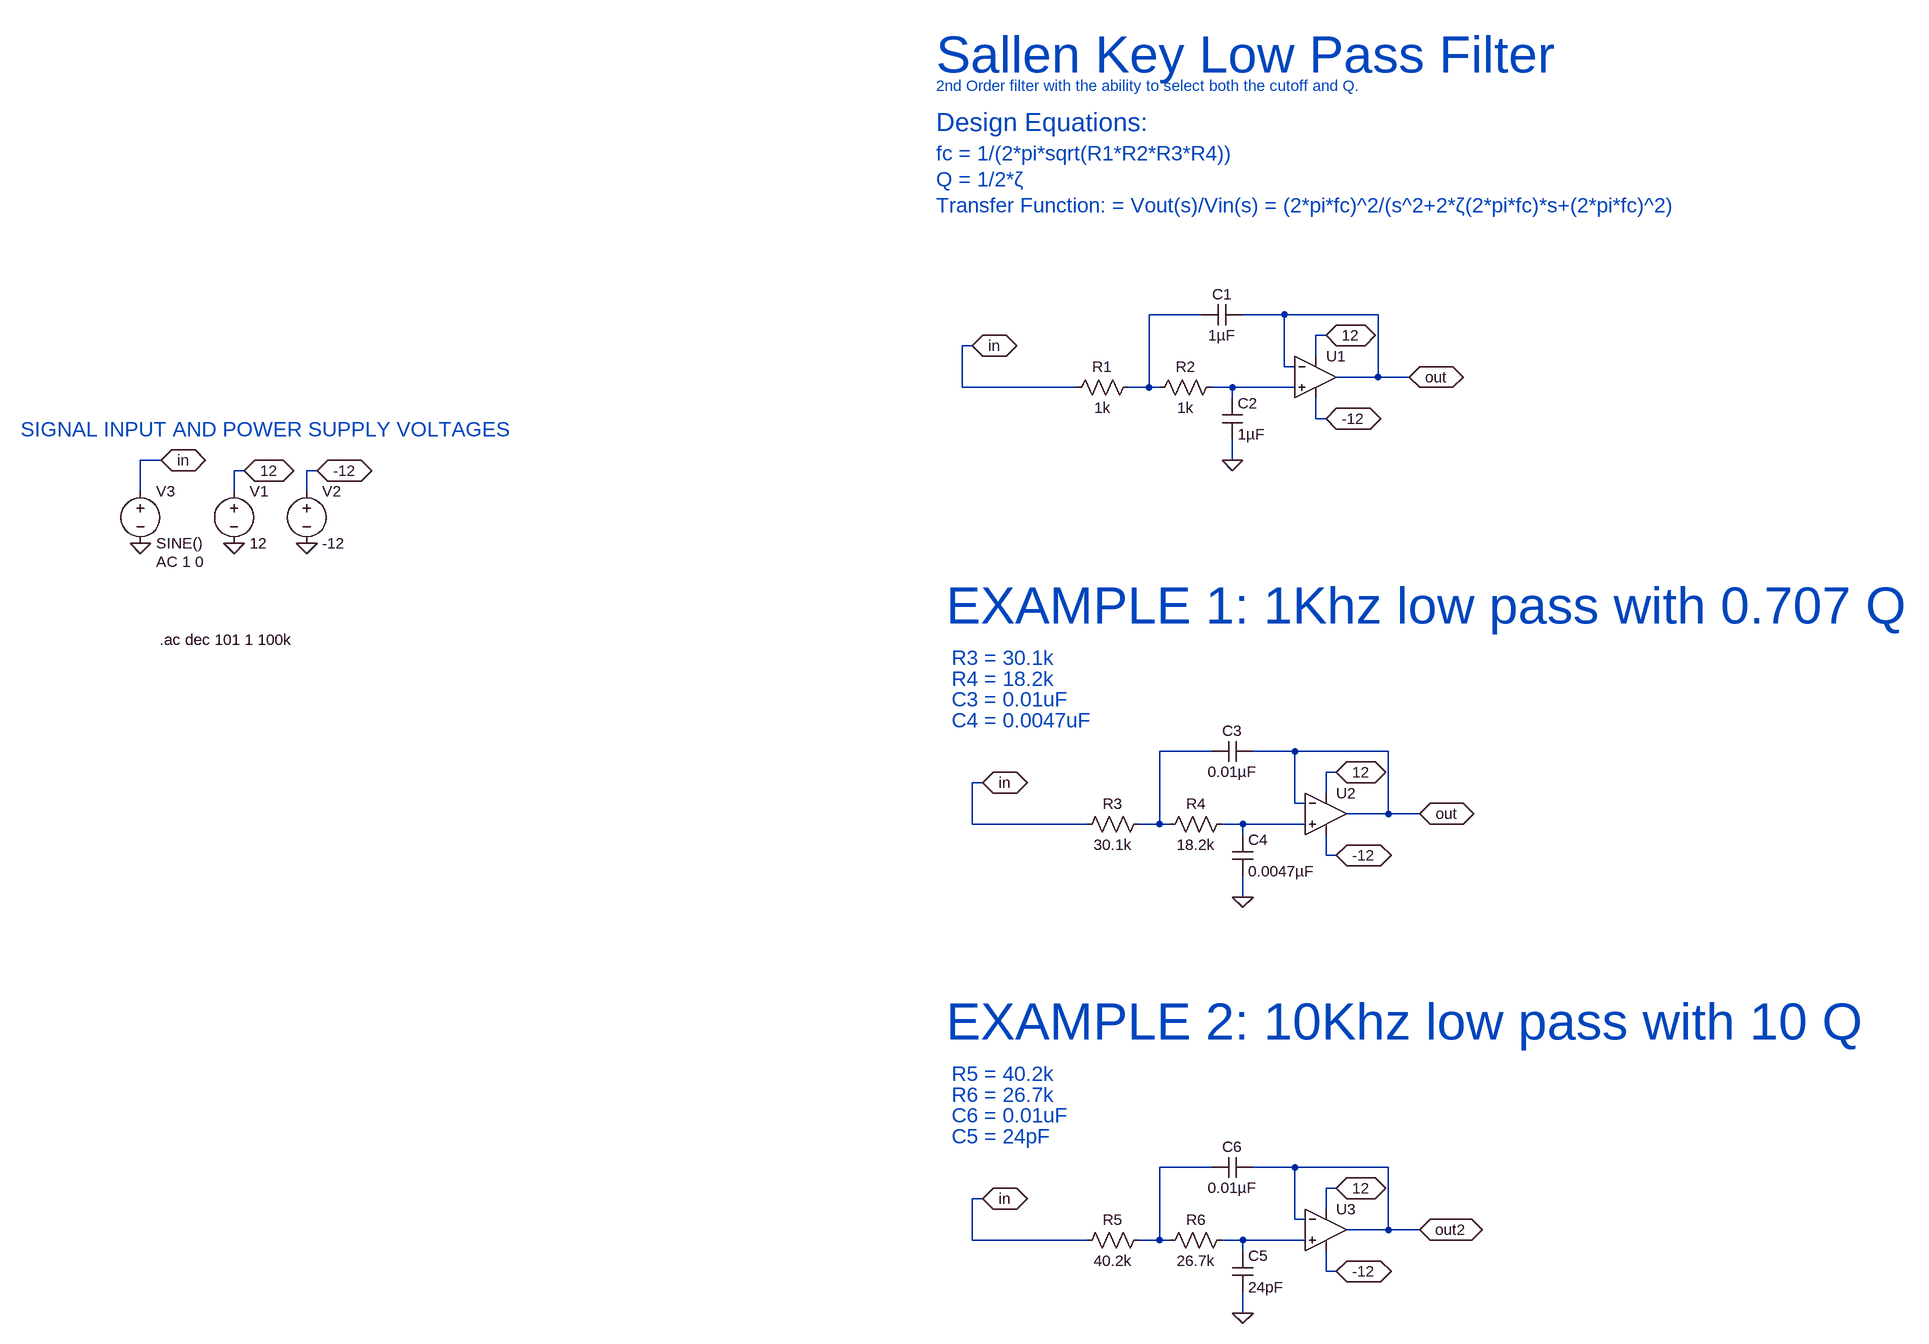
[diagram p0: schematic Sallen Key Low Pass.asc]
Sallen Key Low Pass.asc, the LTspice schematic file:
Version 4
SHEET 1 1684 1572
WIRE 64 16 -16 16
WIRE 192 16 128 16
WIRE 336 16 192 16
WIRE 256 48 240 48
WIRE -288 64 -304 64
WIRE 240 80 240 48
WIRE 192 96 192 16
WIRE 208 96 192 96
WIRE 336 112 336 16
WIRE 336 112 272 112
WIRE 384 112 336 112
WIRE -304 128 -304 64
WIRE -128 128 -304 128
WIRE -16 128 -16 16
WIRE -16 128 -48 128
WIRE 0 128 -16 128
WIRE 112 128 80 128
WIRE 208 128 112 128
WIRE 112 144 112 128
WIRE 240 176 240 144
WIRE 256 176 240 176
WIRE -1536 240 -1568 240
WIRE 112 240 112 208
WIRE -1408 256 -1424 256
WIRE -1296 256 -1312 256
WIRE -1568 288 -1568 240
WIRE -1424 288 -1424 256
WIRE -1312 288 -1312 256
WIRE 80 688 0 688
WIRE 208 688 144 688
WIRE 352 688 208 688
WIRE 272 720 256 720
WIRE -272 736 -288 736
WIRE 256 752 256 720
WIRE 208 768 208 688
WIRE 224 768 208 768
WIRE 352 784 352 688
WIRE 352 784 288 784
WIRE 400 784 352 784
WIRE -288 800 -288 736
WIRE -112 800 -288 800
WIRE 0 800 0 688
WIRE 0 800 -32 800
WIRE 16 800 0 800
WIRE 128 800 96 800
WIRE 224 800 128 800
WIRE 128 816 128 800
WIRE 256 848 256 816
WIRE 272 848 256 848
WIRE 128 912 128 880
WIRE 80 1328 0 1328
WIRE 208 1328 144 1328
WIRE 352 1328 208 1328
WIRE 272 1360 256 1360
WIRE -272 1376 -288 1376
WIRE 256 1392 256 1360
WIRE 208 1408 208 1328
WIRE 224 1408 208 1408
WIRE 352 1424 352 1328
WIRE 352 1424 288 1424
WIRE 400 1424 352 1424
WIRE -288 1440 -288 1376
WIRE -112 1440 -288 1440
WIRE 0 1440 0 1328
WIRE 0 1440 -32 1440
WIRE 16 1440 0 1440
WIRE 128 1440 96 1440
WIRE 224 1440 128 1440
WIRE 128 1456 128 1440
WIRE 256 1488 256 1456
WIRE 272 1488 256 1488
WIRE 128 1552 128 1520
FLAG 256 48 12
IOPIN 256 48 BiDir
FLAG 256 176 -12
IOPIN 256 176 BiDir
FLAG -1408 256 12
IOPIN -1408 256 BiDir
FLAG -1296 256 -12
IOPIN -1296 256 BiDir
FLAG -1424 368 0
FLAG -1312 368 0
FLAG 112 240 0
FLAG -1568 368 0
FLAG -1536 240 in
IOPIN -1536 240 BiDir
FLAG -288 64 in
IOPIN -288 64 BiDir
FLAG 384 112 out
IOPIN 384 112 BiDir
FLAG 272 720 12
IOPIN 272 720 BiDir
FLAG 272 848 -12
IOPIN 272 848 BiDir
FLAG 128 912 0
FLAG -272 736 in
IOPIN -272 736 BiDir
FLAG 400 784 out
IOPIN 400 784 BiDir
FLAG 272 1360 12
IOPIN 272 1360 BiDir
FLAG 272 1488 -12
IOPIN 272 1488 BiDir
FLAG 128 1552 0
FLAG -272 1376 in
IOPIN -272 1376 BiDir
FLAG 400 1424 out2
IOPIN 400 1424 BiDir
SYMBOL Opamps\\UniversalOpamp2 240 112 R0
SYMATTR InstName U1
SYMBOL voltage -1424 272 R0
SYMATTR InstName V1
SYMATTR Value 12
SYMBOL voltage -1312 272 R0
SYMATTR InstName V2
SYMATTR Value -12
SYMBOL res -32 112 R90
WINDOW 0 0 56 VBottom 2
WINDOW 3 32 56 VTop 2
SYMATTR InstName R1
SYMATTR Value 1k
SYMBOL res 96 112 R90
WINDOW 0 0 56 VBottom 2
WINDOW 3 32 56 VTop 2
SYMATTR InstName R2
SYMATTR Value 1k
SYMBOL cap 96 144 R0
SYMATTR InstName C2
SYMATTR Value 1µF
SYMBOL cap 128 0 R90
WINDOW 0 0 32 VBottom 2
WINDOW 3 32 32 VTop 2
SYMATTR InstName C1
SYMATTR Value 1µF
SYMBOL voltage -1568 272 R0
WINDOW 123 24 124 Left 2
WINDOW 39 0 0 Left 0
SYMATTR InstName V3
SYMATTR Value SINE()
SYMATTR Value2 AC 1 0
SYMBOL Opamps\\UniversalOpamp2 256 784 R0
SYMATTR InstName U2
SYMBOL res -16 784 R90
WINDOW 0 0 56 VBottom 2
WINDOW 3 32 56 VTop 2
SYMATTR InstName R3
SYMATTR Value 30.1k
SYMBOL res 112 784 R90
WINDOW 0 0 56 VBottom 2
WINDOW 3 32 56 VTop 2
SYMATTR InstName R4
SYMATTR Value 18.2k
SYMBOL cap 112 816 R0
SYMATTR InstName C4
SYMATTR Value 0.0047µF
SYMBOL cap 144 672 R90
WINDOW 0 0 32 VBottom 2
WINDOW 3 32 32 VTop 2
SYMATTR InstName C3
SYMATTR Value 0.01µF
SYMBOL Opamps\\UniversalOpamp2 256 1424 R0
SYMATTR InstName U3
SYMBOL res -16 1424 R90
WINDOW 0 0 56 VBottom 2
WINDOW 3 32 56 VTop 2
SYMATTR InstName R5
SYMATTR Value 40.2k
SYMBOL res 112 1424 R90
WINDOW 0 0 56 VBottom 2
WINDOW 3 32 56 VTop 2
SYMATTR InstName R6
SYMATTR Value 26.7k
SYMBOL cap 112 1456 R0
SYMATTR InstName C5
SYMATTR Value 24pF
SYMBOL cap 144 1312 R90
WINDOW 0 0 32 VBottom 2
WINDOW 3 32 32 VTop 2
SYMATTR InstName C6
SYMATTR Value 0.01µF
TEXT -344 -384 Left 6 ;Sallen Key Low Pass Filter
TEXT -344 -336 Left 2 ;2nd Order filter with the ability to select both the cutoff and Q.
TEXT -344 -232 Left 3 ;fc = 1/(2*pi*sqrt(R1*R2*R3*R4))
TEXT -344 -192 Left 3 ;Q = 1/2*ζ
TEXT -344 -280 Left 4 ;Design Equations:
TEXT -344 -152 Left 3 ;Transfer Function: = Vout(s)/Vin(s) = (2*pi*fc)^2/(s^2+2*ζ(2*pi*fc)*s+(2*pi*fc)^2)
TEXT -328 464 Left 6 ;EXAMPLE 1: 1Khz low pass with 0.707 Q
TEXT -320 544 Left 3 ;R3 = 30.1k
TEXT -320 576 Left 3 ;R4 = 18.2k
TEXT -320 608 Left 3 ;C3 = 0.01uF
TEXT -320 640 Left 3 ;C4 = 0.0047uF
TEXT -1538 516 Left 2 !.ac dec 101 1 100k
TEXT -1752 192 Left 3 ;SIGNAL INPUT AND POWER SUPPLY VOLTAGES
TEXT -328 1104 Left 6 ;EXAMPLE 2: 10Khz low pass with 10 Q
TEXT -320 1184 Left 3 ;R5 = 40.2k
TEXT -320 1216 Left 3 ;R6 = 26.7k
TEXT -320 1248 Left 3 ;C6 = 0.01uF
TEXT -320 1280 Left 3 ;C5 = 24pF

The netlist it stands for:
* Sallen Key Low Pass.asc
XU1 N002 out 12 -12 out level.2 Avol=1Meg GBW=10Meg Slew=10Meg ilimit=25m rail=0 Vos=0 phimargin=45 en=0 enk=0 in=0 ink=0 Rin=500Meg  ; pins IN+ IN- V+ V- OUT
V1 12 0 12
V2 -12 0 -12
R1 N001 in 1k
R2 N002 N001 1k
C2 N002 0 1µF
C1 out N001 1µF
V3 in 0 SINE() AC 1 0
XU2 N004 out 12 -12 out level.2 Avol=1Meg GBW=10Meg Slew=10Meg ilimit=25m rail=0 Vos=0 phimargin=45 en=0 enk=0 in=0 ink=0 Rin=500Meg  ; pins IN+ IN- V+ V- OUT
R3 N003 in 30.1k
R4 N004 N003 18.2k
C4 N004 0 0.0047µF
C3 out N003 0.01µF
XU3 N006 out2 12 -12 out2 level.2 Avol=1Meg GBW=10Meg Slew=10Meg ilimit=25m rail=0 Vos=0 phimargin=45 en=0 enk=0 in=0 ink=0 Rin=500Meg  ; pins IN+ IN- V+ V- OUT
R5 N005 in 40.2k
R6 N006 N005 26.7k
C5 N006 0 24pF
C6 out2 N005 0.01µF
* Sallen Key Low Pass Filter
* 2nd Order filter with the ability to select both the cutoff and Q.
* fc = 1/(2*pi*sqrt(R1*R2*R3*R4))
* Q = 1/2*ζ
* Design Equations:
* Transfer Function: = Vout(s)/Vin(s) = (2*pi*fc)^2/(s^2+2*ζ(2*pi*fc)*s+(2*pi*fc)^2)
* EXAMPLE 1: 1Khz low pass with 0.707 Q
* R3 = 30.1k
* R4 = 18.2k
* C3 = 0.01uF
* C4 = 0.0047uF
.ac dec 101 1 100k
* SIGNAL INPUT AND POWER SUPPLY VOLTAGES
* EXAMPLE 2: 10Khz low pass with 10 Q
* R5 = 40.2k
* R6 = 26.7k
* C6 = 0.01uF
* C5 = 24pF
.lib UniversalOpamps2.sub
.backanno
.end